# EasyEDA Pro project GIM4310-36(伺泰威新款电机).epro, board PCB1
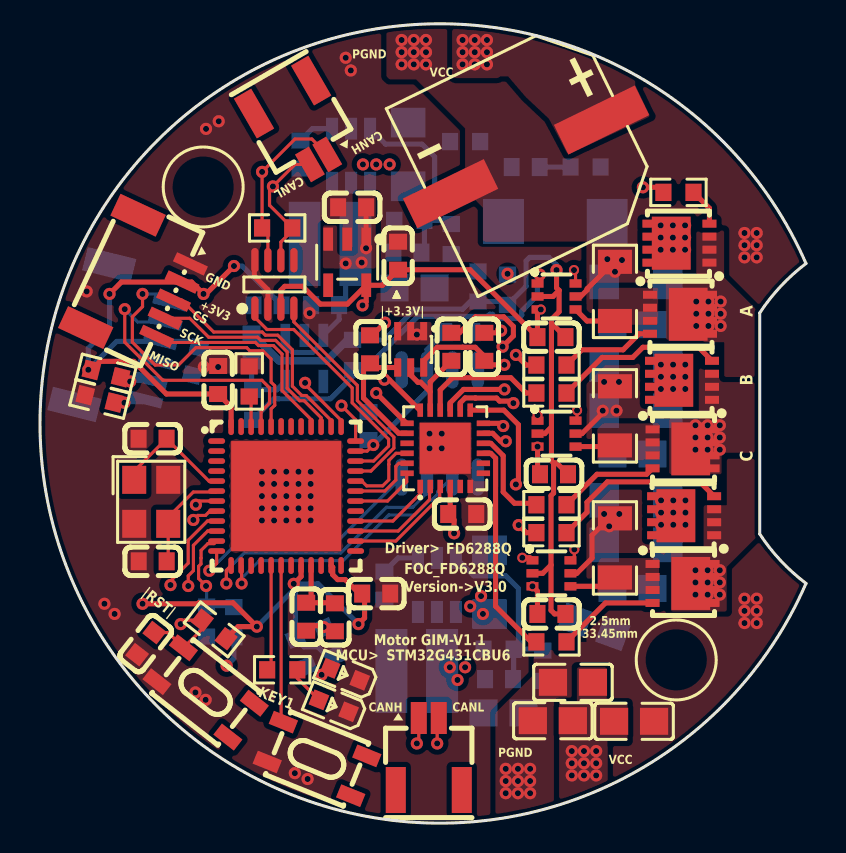
[diagram p1: board, top side]
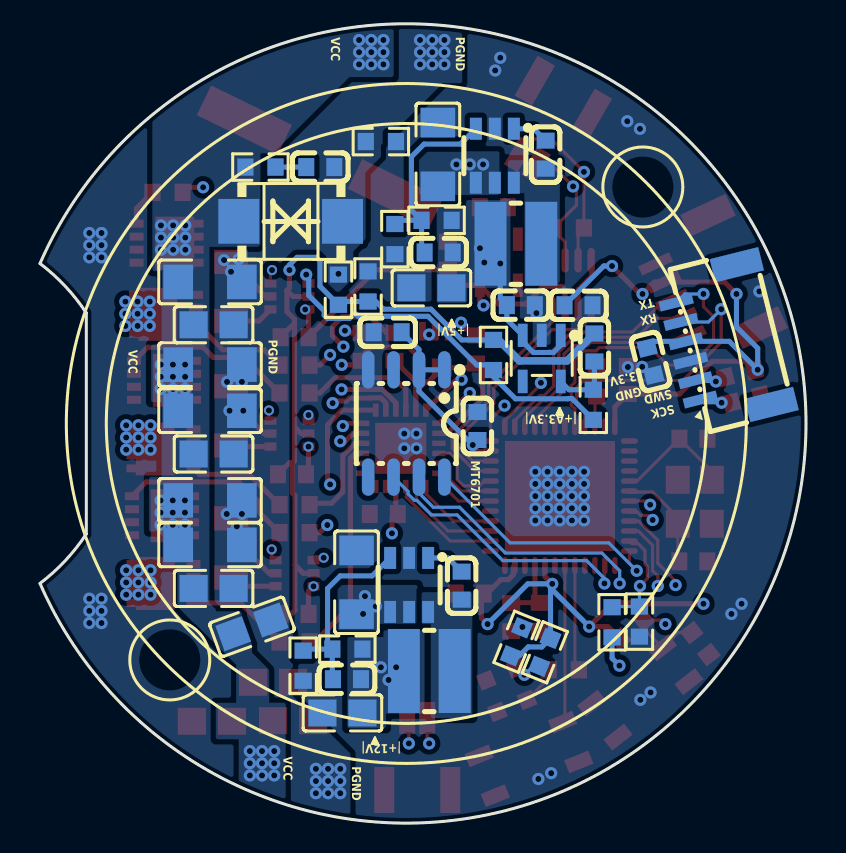
[diagram p2: board, bottom side, seen from below]

Outline 38.3 x 39.97 mm; copper layers: Top Layer, Inner1, Inner2, Inner3, Inner4, Inner5, Inner6, Inner7, Inner8, Inner9, Inner10, Inner11, Inner12, Inner13, Inner14, Inner15, Inner16, Inner17, Inner18, Inner19, Inner20, Inner21, Inner22, Inner23, Inner24, Inner25, Inner26, Inner27, Inner28, Inner29, Inner30, Bottom Layer. Coordinates in mm from the lower left corner of the outline.
Outline path: 35.99,25.52 arc(37.04,26.85) 38.3,27.99 arc(0,19.99) 38.3,11.99 arc(37.04,13.13) 35.99,14.46 35.99,25.52
Stack: Top Layer 0.035mm 外层铜厚1oz / Dielectric1 0.2104mm 7628 RC49% 8.6mil / Inner1 0.0152mm 内层铜厚 / Dielectric2 1.065mm 1.1mm H/HOZ Copper / Inner2 0.0152mm 内层铜厚 / Dielectric3 0.2104mm 7628 RC49% 8.6mil / Bottom Layer 0.035mm 外层铜厚1oz

## Design rules (mm)
spacing copperThickness1oz (default): track to track 0.102, other pairs 0.152 to 0.3
spacing copperThickness2oz: track to track 0.203, other pairs 0.152 to 0.3
spacing Plane_innerPlane: track to track 0.102, other pairs 0.152 to 0.3
spacing Copper_copperRegion: track to track 0.102, other pairs 0.152 to 0.3
track width copperThickness1oz (default): min 0.127, default 0.254, max 2.54
track width copperThickness2oz: min 0.203, default 0.254, max 2.54
differential pair differentialPair (default): width min 0.127, default 0.254, max 2.54; gap min 0.152, default 0.152
pour e969 uses Copper_copperRegion
pour e971 uses Copper_copperRegion
pour e973 uses Copper_copperRegion
pour e975 uses Copper_copperRegion
pour e977 uses Copper_copperRegion
pour e979 uses Copper_copperRegion
pour e981 uses Copper_copperRegion
pour e983 uses Copper_copperRegion
pour e985 uses Copper_copperRegion
pour e987 uses Copper_copperRegion
pour e989 uses Copper_copperRegion
pour e991 uses Copper_copperRegion
pour e993 uses Copper_copperRegion
pour e995 uses Copper_copperRegion
pour e997 uses Copper_copperRegion
pour e999 uses Copper_copperRegion
pour e1001 uses Copper_copperRegion
pour e1003 uses Copper_copperRegion
pour e1005 uses Copper_copperRegion
pour e1007 uses Copper_copperRegion
pour e1009 uses Copper_copperRegion
pour e1010 uses Copper_copperRegion
pour e1012 uses Copper_copperRegion
pour e1014 uses Copper_copperRegion
pour e1016 uses Copper_copperRegion
pour e1018 uses Copper_copperRegion
pour e1020 uses Copper_copperRegion
pour e1022 uses Copper_copperRegion
pour e1027 uses Copper_copperRegion
pour e1030 uses Copper_copperRegion
pour e1033 uses Copper_copperRegion
pour e1036 uses Copper_copperRegion
pour e1039 uses Copper_copperRegion
pour e1046 uses Copper_copperRegion
pour e1048 uses Copper_copperRegion

## Placement (name value [footprint] x y rotation side)
C12  47uF/50V  [C1206]  18.41 33.44 270 bottom
C13  100pF  [C0603]  18.37 28.54 180 bottom
C14  22uF/25V  [C0805]  18.73 26.77 180 bottom
C29  10uF  [C0603]  11.38 25.9 0 bottom
C35  100nF  [C0603]  16.81 11.48 180 top
C36  100nF  [C0603]  16.43 19.86 270 bottom
C37  100nF  [C0603]  8.91 22.16 270 top
C41  1uF  [C0603]  14.74 10.3 270 top
C42  10nF  [C0603]  13.31 10.33 270 top
C45  100nF  [C0603]  5.29 8.98 232 top
C54  10nF/50V  [C0603]  24.29 32.81 180 bottom
C55  22uF/50V  [C1206]  29.8 16.14 0 bottom
C61  22uF/50V  [C1206]  29.8 13.92 0 bottom
C65  100nF  [C0603]  17.91 28.38 90 top
C68  100nF  [C0603]  20.92 24.55 0 bottom
C71  20pF  [C0603]  5.63 19.23 0 top
C72  20pF  [C0603]  5.63 13.1 0 top
C100  100nF  [C0603]  13.02 33.43 270 bottom
C101  100nF  [C0603]  17.22 11.88 270 bottom
C102  47uF/50V  [C1206]  22.48 12.05 270 bottom
C103  100pF  [C0603]  22.95 7.2 180 bottom
C104  22uF/25V  [C0805]  23.18 5.51 180 bottom
C105  100nF  [C0603]  15.61 30.8 180 top
C106  100nF  [C0603]  10.58 23.79 90 bottom
C107  100nF  [C0603]  14.26 25.91 180 bottom
C108  22uF/50V  [C1206]  29.8 20.63 0 bottom
C109  22uF/50V  [C1206]  29.8 22.93 0 bottom
C112  100nF  [C0603]  7.77 23.09 76 bottom
C120  100nF  [C0603]  25.57 24.31 180 top
C121  100nF  [C0603]  25.7 17.45 180 top
C122  100nF  [C0603]  25.57 10.46 180 top
C123  1uF/25V  [C0603]  16.5 23.7 270 top
C124  1uF/25V  [C0603]  20.57 23.82 270 top
C125  1uF/25V  [C0603]  22.22 23.82 270 top
C126  10uF/25V  [C0603]  21.11 15.46 180 top
C127  22uF/50V  [C1206]  29.8 27.07 0 bottom
C130  330uF  [CAP-SMD_BD10.0-L10.3-W10.3-FD-LS11.0]  24.3 33.32 206 top
C131  10uF/50V  [C0805]  29.62 24.93 0 bottom
C132  10uF/50V  [C0805]  29.62 18.46 0 bottom
C133  10uF/50V  [C0805]  29.62 11.74 0 bottom
C134  10uF/50V  [C0805]  25.64 5.12 0 top
C136  10uF/50V  [C0805]  29.71 5.1 180 top
C138  10uF/50V  [C0805]  26.65 7.04 0 top
C139  10uF/50V  [C0805]  27.7 9.82 340 bottom
D3  BAS16TW  [SOT-363_L2.1-W1.3-P0.65-LS2.3-BL]  18.54 23.7 180 top
D4  SMBJ36CA  [SMB_L4.4-W3.6-LS5.3-BI]  25.77 30.1 180 bottom
L1  3.3uH  [IND-SMD_L3.8-W3.8_GCRH3D16-XX]  18.84 7.61 0 bottom
L2  3.3uH  [IND-SMD_L3.8-W3.8_GCRH3D16-XX]  14.51 28.97 0 bottom
LED6  KT-0603R  [LED0603-RD]  15.25 7.44 158 top
LED7  KT-0603R  [LED0603-RD]  14.69 5.87 158 top
Q7  NCEP3040Q  [POWERVDFN-8_L3.2-W3.1-P0.65-LS3.3-BL-1]  31.92 29.01 90 top
Q8  NCEP3040Q  [POWERVDFN-8_L3.2-W3.1-P0.65-LS3.3-BL-1]  32.05 22.15 90 top
Q9  NCEP3040Q  [POWERVDFN-8_L3.2-W3.1-P0.65-LS3.3-BL-1]  32.16 15.38 90 top
Q10  NCEP3040Q  [POWERVDFN-8_L3.2-W3.1-P0.65-LS3.3-BL-1]  32.05 25.45 270 top
Q11  NCEP3040Q  [POWERVDFN-8_L3.2-W3.1-P0.65-LS3.3-BL-1]  32.18 18.72 270 top
Q12  NCEP3040Q  [POWERVDFN-8_L3.2-W3.1-P0.65-LS3.3-BL-1]  32.18 11.99 270 top
R24  120  [R0603]  11.86 29.77 0 top
R28  0  [R0603]  14.48 9.07 292 bottom
R29  10K  [R0603]  10.46 22.09 90 top
R30  1K  [R0603]  8.71 9.69 142 top
R33  3.3  [R0603]  27.28 32.81 0 bottom
R42  10  [R0603]  31.92 31.55 0 top
R52  10  [R0603]  25.57 21.51 0 top
R53  10  [R0603]  25.57 14.53 0 top
R54  10  [R0603]  25.57 22.91 0 top
R56  10  [R0603]  25.57 9.07 0 top
R60  10  [R0603]  25.57 15.93 0 top
R65  34.8K  [R0603]  9.69 10.05 270 bottom
R67  4.99K  [R0603]  8.33 10.08 90 bottom
R68  3mΩ  [R1206]  28.75 26.59 270 top
R69  3mΩ  [R1206]  28.75 20.37 270 top
R70  3mΩ  [R1206]  28.75 13.77 270 top
R72  110K  [R0603]  18.47 30.15 0 bottom
R73  15K  [R0603]  20.56 29.21 90 bottom
R74  390K  [R0603]  22.93 8.7 0 bottom
R75  20K  [R0603]  25.14 7.87 90 bottom
R79  1K  [R0603]  13.06 8.55 292 bottom
R80  0  [R0603]  21.9 26.84 270 bottom
R81  0  [R0603]  21.26 34.09 0 bottom
R82  0  [R0603]  23.38 26.68 90 bottom
R85  10K  [R0603]  3.3 22.48 166 top
R86  10K  [R0603]  2.99 21.22 346 top
R101  10K  [R0603]  10.64 20.92 270 bottom
R102  10K  [R0603]  15.63 23.41 90 bottom
R103  1K  [R0603]  12.11 7.67 0 top
SW1  K2-1808SN-A3SW-01  [SW-SMD_4P-L4.2-W3.3-P2.15-LS5.1]  8.28 6.54 322 top
SW3  K2-1808SN-A3SW-01  [SW-SMD_4P-L4.2-W3.3-P2.15-LS5.1]  13.85 3.21 338 top
U1  STM32G431CBU6  [VQFN-48_L7.0-W7.0-P0.50-BL-EP5.5]  12.31 16.36 270 top
U2  INA199A1DCKR  [SC-70-6_L2.2-W1.3-P0.65-LS2.1-BR]  25.83 26.34 180 top
U4  INA199A1DCKR  [SC-70-6_L2.2-W1.3-P0.65-LS2.1-BR]  25.57 12.5 180 top
U5  MAX3051EKA+T  [SOT-23-8_L3.0-W1.7-P0.65-LS2.8-TL]  11.72 26.94 90 top
U10  FD6288Q  [QFN-24_L4.0-W4.0-P0.50-BL-EP2.6]  20.26 18.75 0 top
U11  MT6701CT-STD  [SOP-8_L4.9-W3.9-P1.27-LS6.0-BL]  19.99 19.99 0 bottom
U13  SPX3819M5-L-3-3/TR  [SOT-23-5_L3.0-W1.7-P0.95-LS2.8-BL]  15.36 28.05 180 top
U20  INA199A1DCKR  [SC-70-6_L2.2-W1.3-P0.65-LS2.1-BR]  25.83 19.48 180 top
U23  ME3121AM6G  [SOT-23-6_L2.9-W1.6-P0.95-LS2.8-BR]  15.56 33.38 90 bottom
U24  ME3121AM6G  [SOT-23-6_L2.9-W1.6-P0.95-LS2.8-BR]  19.85 11.91 90 bottom
U25  SPX3819M5-L-3-3/TR  [SOT-23-5_L3.0-W1.7-P0.95-LS2.8-BL]  13.21 23.24 0 bottom
U27  ZX-SH1.0-2PWT  [CONN-SMD_2P-P1.00_HX-1.0-2P-WT]  19.44 3.46 0 top
U28  ZX-SH1.0-2PWT  [CONN-SMD_2P-P1.00_HX-1.0-2P-WT]  13.03 34.75 210 top
U29  ZX-SH1.0-6PWT  [CONN-SMD_6P-P1.00_MEGASTAR_ZX-SH1.0-6PWT]  4.24 24.02 76 bottom
U30  ZX-SH1.0-5PWT  [CONN-SMD_5P-P1.00_MEGASTAR_ZX-SH1.0-5PWT]  5.14 26.87 245 top
X3  8MHz  [CRYSTAL-SMD_4P-L3.2-W2.5-BL]  5.56 16.07 270 top

## Footprints (pads in the part's own frame, mm; a bottom-side part is the same pattern mirrored in y, then rotated)
C0603
  rect 0.8x0.9 smd: 1(-0.7,0) 2(0.7,0)
C0805
  rect 1.41x1.35 smd: 1(-1,0) 2(1,0)
C1206
  rect 1.485x1.728 smd: 1(-1.593,0) 2(1.593,0)
CAP-SMD_BD10.0-L10.3-W10.3-FD-LS11.0
  rect 4.5x1.65 smd: 1(-4.2,0) 2(4.2,0)
CONN-SMD_2P-P1.00_HX-1.0-2P-WT
  rect 0.8x1.6 smd: 1(-0.5,1.8) 2(0.5,1.8)
  rect 1x2.3 smd: 3(1.65,-1.8) 4(-1.65,-1.8)
CONN-SMD_5P-P1.00_MEGASTAR_ZX-SH1.0-5PWT
  rect 0.5x1.7 smd: 1(-2,1.7) 2(-1,1.7) 3(0,1.7) 4(1,1.7) 5(2,1.7)
  rect 1.2x2.5 smd: 6(3.1,-1.7) 7(-3.1,-1.7)
CONN-SMD_6P-P1.00_MEGASTAR_ZX-SH1.0-6PWT
  rect 0.5x1.7 smd: 1(-2.5,1.7) 2(-1.5,1.7) 3(-0.5,1.7) 4(0.5,1.7) 5(1.5,1.7) 6(2.5,1.7)
  rect 1.2x2.5 smd: 7(3.6,-1.7) 8(-3.6,-1.7)
CRYSTAL-SMD_4P-L3.2-W2.5-BL
  rect 1.4x1.2 smd: 1(-1.1,-0.85) 2(1.1,-0.85) 3(1.1,0.85) 4(-1.1,0.85)
IND-SMD_L3.8-W3.8_GCRH3D16-XX
  rect 1.6x4.2 smd: 1(-1.27,0) 2(1.27,0)
LED0603-RD
  rect 0.8x0.8 smd: 1(-0.799,0) 2(0.799,0)
POWERVDFN-8_L3.2-W3.1-P0.65-LS3.3-BL-1
  rect 0.4x0.7 smd: 1(-0.975,-1.55) 2(-0.325,-1.55) 3(0.325,-1.55) 4(0.975,-1.55)
  rect 0.4x0.5 smd: 5(0.975,1.55) 6(0.325,1.55) 7(-0.325,1.55) 8(-0.975,1.55)
  rect 2.65x1.94 smd: 8(0,0.36)
QFN-24_L4.0-W4.0-P0.50-BL-EP2.6
  rect 0.28x0.665 smd: 1(-1.25,-1.907) 2(-0.75,-1.907) 3(-0.25,-1.907) 4(0.25,-1.907) 5(0.75,-1.907) 6(1.25,-1.907) 13(1.25,1.907) 14(0.75,1.907) 15(0.25,1.907) 16(-0.25,1.907) 17(-0.75,1.907) 18(-1.25,1.907)
  rect 0.665x0.28 smd: 7(1.907,-1.25) 8(1.907,-0.75) 9(1.907,-0.25) 10(1.907,0.25) 11(1.907,0.75) 12(1.907,1.25) 19(-1.907,1.25) 20(-1.907,0.75) 21(-1.907,0.25) 22(-1.907,-0.25) 23(-1.907,-0.75) 24(-1.907,-1.25)
  rect 2.55x2.55 smd: 25(0,0)
R0603
  rect 0.806x0.864 smd: 1(-0.753,0) 2(0.753,0)
R1206
  rect 1.208x1.701 smd: 1(-1.479,0) 2(1.479,0)
SC-70-6_L2.2-W1.3-P0.65-LS2.1-BR
  rect 0.6x0.42 smd: 1(0.95,-0.65) 2(0.95,0) 3(0.95,0.65) 4(-0.95,0.65) 5(-0.95,0) 6(-0.95,-0.65)
SMB_L4.4-W3.6-LS5.3-BI
  rect 2.047x2.241 smd: 1(-2.591,0) 2(2.591,0)
SOP-8_L4.9-W3.9-P1.27-LS6.0-BL
  oval 0.63x1.865 smd: 1(-1.905,-2.683) 2(-0.635,-2.683) 3(0.635,-2.683) 4(1.905,-2.683) 5(1.905,2.683) 6(0.635,2.683) 7(-0.635,2.683) 8(-1.905,2.683)
SOT-23-5_L3.0-W1.7-P0.95-LS2.8-BL
  rect 0.49x1.157 smd: 1(-0.95,-1.153) 2(0,-1.153) 3(0.95,-1.153)
  rect 0.49x1.175 smd: 4(0.95,1.153) 5(-0.95,1.153)
SOT-23-6_L2.9-W1.6-P0.95-LS2.8-BR
  rect 1.1x0.6 smd: 1(1.35,-0.95) 2(1.35,0) 3(1.35,0.95) 4(-1.35,0.95) 5(-1.35,0) 6(-1.35,-0.95)
SOT-23-8_L3.0-W1.7-P0.65-LS2.8-TL
  oval 1.222x0.364 smd: 1(-1.211,0.975) 2(-1.211,0.325) 3(-1.211,-0.325) 4(-1.211,-0.975) 5(1.211,-0.975) 6(1.211,-0.325) 7(1.211,0.325) 8(1.211,0.975)
SOT-363_L2.1-W1.3-P0.65-LS2.3-BL
  rect 0.35x0.916 smd: 1(-0.65,-0.908) 2(0,-0.908) 3(0.65,-0.908) 4(0.65,0.908) 5(0,0.908) 6(-0.65,0.908)
SW-SMD_4P-L4.2-W3.3-P2.15-LS5.1
  rect 1.3x0.7 smd: 1(-2.25,1.075) 2(2.25,1.075) 3(-2.25,-1.075) 4(2.25,-1.075)
VQFN-48_L7.0-W7.0-P0.50-BL-EP5.5
  oval 0.28x0.85 smd: 1(-2.75,-3.474) 2(-2.25,-3.474) 3(-1.75,-3.474) 4(-1.25,-3.474) 5(-0.75,-3.474) 6(-0.25,-3.474) 7(0.25,-3.474) 8(0.75,-3.474) 9(1.25,-3.474) 10(1.75,-3.474) 11(2.25,-3.474) 12(2.75,-3.474) 25(2.75,3.474) 26(2.25,3.474) 27(1.75,3.474) 28(1.25,3.474) 29(0.75,3.474) 30(0.25,3.474) 31(-0.25,3.474) 32(-0.75,3.474) 33(-1.25,3.474) 34(-1.75,3.474) 35(-2.25,3.474) 36(-2.75,3.474)
  oval 0.85x0.28 smd: 13(3.474,-2.75) 14(3.474,-2.25) 15(3.474,-1.75) 16(3.474,-1.25) 17(3.474,-0.75) 18(3.474,-0.25) 19(3.474,0.25) 20(3.474,0.75) 21(3.474,1.25) 22(3.474,1.75) 23(3.474,2.25) 24(3.474,2.75) 37(-3.474,2.75) 38(-3.474,2.25) 39(-3.474,1.75) 40(-3.474,1.25) 41(-3.474,0.75) 42(-3.474,0.25) 43(-3.474,-0.25) 44(-3.474,-0.75) 45(-3.474,-1.25) 46(-3.474,-1.75) 47(-3.474,-2.25) 48(-3.474,-2.75)
  rect 5.5x5.5 smd: 49(0,0)

## Nets
As in the schematic.

Pads without a net: SW1 2 4; SW3 2 4; U1 1 2 3 4 15 16 19 22 24 25 29 41 42 43 47; U5 5; U10 5 7 8 21; U11 3 5; U13 4; U25 4; U27 3 4; U28 3 4; U29 7 8; U30 6 7

## Via types
v1: diameter 0.61, hole 0.305, Top Layer to Bottom Layer, 218 vias
v2: diameter 0.508, hole 0.305, Top Layer to Bottom Layer, 8 vias

## Routing (per net, layer and track width the routed paths; a pad name or vN(x,y) marks a point on that pad's centre or on a via; arc(x,y) is an arc through that point)
+3.3V: length 129.8
  Top Layer w0.158: v1(16.66,18.91) 16.36,18.61 15.78,18.61
  Top Layer w0.254: R85.2 3,23.1 4.69,23.1 6.32,21.46 C37.2 9.56,20.81 9.56,19.83 ; v1(16.13,25.89) 16.31,26.08 U13.5 ; v2(24.88,18.83) 24.88,17.57 C121.2 ; U13.5 15.37,25.96 14.02,25.96 13.13,26.85 12.24,26.85 12.05,26.65 12.05,25.73 ; U13.5 17.13,26.9 C65.1 21.5,27.68 C120.2 24.87,25.52 v2(25.04,25.69) ; U1.23 14.64,12.8 14.64,12.43 14.88,12.18 15.26,12.18 15.88,11.56 16.23,11.56 16.23,10.26 v1(15.92,9.96) ; v1(5.13,10.97) 7.9,10.97 7.95,11.02 9.65,11.02 v1(10.84,9.83) 9.91,9.83 R30.1 ; v1(3.48,26.47) 4.07,27.06 U30.2 7.58,27.06 v1(8.18,26.47) 8.3,26.47 v1(9.7,27.86) ; U1.20 13.06,12.34 v1(12.69,11.97) ; C122.2 24.87,11.6 v2(24.62,11.85)
  Inner1 w0.254: v1(16.66,18.91) 15.8,19.78 15.8,24.94 16.13,25.27 v1(16.13,25.89) ; v1(5.13,10.97) 2.21,13.89 2.21,15.67 1.95,15.93 1.95,22.21 v1(2.42,22.67)
  Inner2 w0.254: v2(24.62,11.85) 24.88,12.1 24.88,13.84 24.91,13.87 24.91,18.54 24.88,18.58 v2(24.88,18.83) 25.45,19.4 25.45,20.86 25.23,21.07 25.23,25.5 v2(25.04,25.69) ; v1(8.18,26.47) 15.55,26.47 v1(16.13,25.89)
  Bottom Layer w0.254: v1(3.48,26.47) 3.48,24.82 2.42,23.75 v1(2.42,22.67) 3.84,24.1 U29.4 7.61,24.1 7.94,23.77 ; v1(9.7,27.86) 10.11,27.86 C29.2 ; C68.1 19.35,23.68 U11.2 ; v1(12.69,11.97) 12.78,11.88 R79.1 13.21,8.81 13.89,8.81 14.33,8.38 R28.2 ; v1(12.69,11.97) 12.69,11.68 v1(10.84,9.83) ; v1(12.69,11.97) 13.91,11.97 v1(15.92,9.96) ; U11.2 19.35,21.6 v1(16.66,18.91) ; U11.2 U11.1
+5V: length 9.2
  Top Layer w0.254: v1(16.3,28.75) 16.31,28.76 C105.1
  Bottom Layer w0.254: v1(15.29,27.99) 15.29,26.24 C107.1 14.96,25.19 U25.3 14.16,24.07 13.64,23.55 13.58,23.55 13.58,23.54 12.85,23.54 12.85,23.55 12.62,23.55 12.26,23.9 U25.1
  vias: v1(16.08,28.04)
+12V: length 2.5
  Top Layer w0.254: U10.4 20.51,15.56 C126.2 20.7,15.17 v1(20.7,14.5)
  vias: v1(18.84,24.43) v1(20.49,7.8) v1(20.88,7.16) v1(21.26,7.8)
+AVDD_3.3V: length 3.2
  Bottom Layer w0.254: C106.1 10.58,21.73 R101.1 11.85,21.68 U25.5
AGND: length 42.5
  Top Layer w0.254: 25.55,12.91 25.55,16.38 25.68,16.51 25.68,18.01 ; 25.55,12.91 25.55,10.64 25.73,10.46 C122.1 ; 25.55,12.91 25.14,12.5 U4.2 ; 25.96,26.65 25.96,25.58 25.57,25.2 25.57,25.01 ; 25.96,26.65 25.83,26.77 v1(25.83,27.66) ; 25.96,26.65 25.65,26.34 U2.2 ; 25.57,25.01 25.57,19.82 ; 25.57,25.01 C120.1 ; 25.57,19.82 25.57,18.12 25.68,18.01 ; 25.57,19.82 25.24,19.48 U20.2 ; C121.1 25.84,18.01 25.68,18.01
  Bottom Layer w0.254: v1(25.83,27.66) 25.83,27.92 25.45,28.3 24.48,28.3 24.3,28.12 24.3,26.85 R82.1 23.22,26.09 R80.2 21.51,26.09 21.13,25.7 18.75,25.7 17.21,24.17 15.63,24.17
  Bottom Layer w0.381: C106.2 11.95,23.12 14.33,23.12 15.37,24.17 15.63,24.17
GND: length 2.7
  Top Layer w0.254: U5.2 11.4,26.68 10.72,27.36 10.72,28.12 U5.8
  vias: v1(2.33,26.59) v1(3.22,10.97) v1(3.73,10.46) v1(7.77,6.54) v1(8.19,22.82) v1(8.3,34.72) v1(8.28,6.17) v1(8.91,22.81) v1(8.94,35.1) v1(11.1,17.58) v1(11.1,16.97) v1(11.1,16.36) v1(11.1,15.75) v1(11.1,15.14) v1(11.71,17.58) v1(11.71,16.97) v1(11.71,16.36) v1(11.71,15.75) v1(11.71,15.14) v1(12.32,17.58) v1(12.32,16.97) v1(12.32,16.36) v1(12.32,15.75) v1(12.32,15.14) v1(12.74,2.5) v1(12.93,17.58) v1(12.93,16.97) v1(12.93,16.36) v1(12.93,15.75) v1(12.93,15.14) v1(13.38,2.21) v1(13.48,25.51) v1(13.53,17.58) v1(13.53,16.97) v1(13.53,16.36) v1(13.53,15.75) v1(13.53,15.14) v1(15.29,38.28) v1(15.54,37.64) v1(19.48,19.48) v1(19.48,18.74) v1(20.09,19.48) v1(20.09,18.74)
PGND: length 8
  Top Layer w0.254: U20.5 27.1,19.48 28.14,20.52 v1(28.14,20.63) ; U4.5 26.84,12.5 27.61,13.26 27.61,14.4 28.05,14.85 v1(28.46,14.85) ; v1(28.75,27.58) 28.21,27.58 27.36,26.73 27.36,26.66 27.03,26.34 U2.5
  vias: v1(18.08,39.17) v1(18.08,38.56) v1(18.08,37.95) v1(18.69,39.17) v1(18.69,38.56) v1(18.69,37.95) v1(19.3,39.17) v1(19.3,38.56) v1(19.3,37.95) v1(23.29,2.72) v1(23.29,2.11) v1(23.29,1.5) v1(23.38,27.47) v1(23.9,2.72) v1(23.9,2.11) v1(23.9,1.5) v1(24.51,2.72) v1(24.51,2.11) v1(24.51,1.5) v1(28.21,22.07) v1(28.21,15.46) v1(28.37,28.21) v1(28.83,20.63) v1(28.95,22.07) v1(28.96,15.46) v1(29.1,28.16) v1(35.23,29.51) v1(35.23,28.9) v1(35.23,28.3) v1(35.23,11.23) v1(35.23,10.62) v1(35.23,10.01) v1(35.84,29.51) v1(35.84,28.9) v1(35.84,28.3) v1(35.84,11.23) v1(35.84,10.62) v1(35.84,10.01)
VCC: length 21.9
  Inner1 w0.254: v1(9.33,7.88) 14.62,2.59 20.88,2.59 22.4,4.11 26.08,4.11 v1(26.59,3.61)
  Bottom Layer w0.254: v1(9.33,7.88) 9.69,8.24 R65.2
  vias: v1(16.15,32.94) v1(16.81,32.94) v1(17.48,32.94) v1(21.13,39.17) v1(21.13,38.56) v1(21.13,37.95) v1(21.51,10.85) v1(21.74,39.17) v1(21.74,38.56) v1(21.74,37.95) v1(22.05,11.35) v1(22.15,10.46) v1(22.35,39.17) v1(22.35,38.56) v1(22.35,37.95) v1(26.59,3) v1(26.59,2.39) v1(27.2,3.61) v1(27.2,3) v1(27.2,2.39) v1(27.81,3.61) v1(27.81,3) v1(27.81,2.39) v1(31.04,29.9) v1(31.04,29.29) v1(31.04,28.68) v1(31.05,22.93) v1(31.05,22.32) v1(31.05,21.71) v1(31.05,16.14) v1(31.05,15.53) v1(31.05,14.92) v1(31.64,29.9) v1(31.64,29.29) v1(31.64,28.68) v1(31.66,22.93) v1(31.66,22.32) v1(31.66,21.71) v1(31.66,16.14) v1(31.66,15.53) v1(31.66,14.92) v1(32.25,29.9) v1(32.25,29.29) v1(32.25,28.68) v1(32.27,22.93) v1(32.27,22.32) v1(32.27,21.71) v1(32.27,16.14) v1(32.27,15.53) v1(32.27,14.92)
VDDA: length 3.4
  Top Layer w0.254: C41.1 14.72,11.03 C42.1 13.56,11.27 U1.21
ADC_IN1: length 47.5
  Top Layer w0.158: v1(7.67,15.16) 7.89,15.39 8.27,15.39 8.43,15.55 8.77,15.55 U1.8 ; U2.6 26.78,27.58 v2(26.7,27.66)
  Inner2 w0.158: v2(26.7,27.66) 26.7,21.78 27.35,21.13 27.35,19.86 27.1,19.61 27.1,14.91 27.48,14.53 27.48,14.26 27.48,14.26 27.48,13.15 27.48,13.15 27.48,12.88 26.08,11.48 26.08,9.96 24.56,8.43 9.7,8.43 7.29,10.85 6.65,10.85 5.89,11.61 5.89,12.12 6.27,12.5 6.65,12.5 7.67,13.51 v1(7.67,15.16)
ADC_IN2: length 37.5
  Top Layer w0.158: v2(26.85,20.64) 26.85,20.21 U20.6 ; v1(6.52,11.91) 6.52,12.11 6.97,12.55 6.97,12.56 7.41,13 7.41,14.15 8.37,15.11 U1.9
  Inner2 w0.158: v1(6.52,11.91) 6.52,11.73 7.03,11.23 7.41,11.23 9.83,8.81 24.43,8.81 25.7,10.08 25.7,11.73 27.23,13.26 27.23,14.15 26.73,14.65 26.73,20.51 v2(26.85,20.64)
ADC_IN3: length 27.6
  Top Layer w0.158: v2(26.72,13.69) 26.72,13.34 26.52,13.15 ; U1.10 8.38,14.61 7.67,13.9 7.67,12.63 7.41,12.37 v1(7.41,11.86)
  Inner2 w0.158: v2(26.72,13.69) 25.32,12.29 25.32,10.34 24.18,9.19 10.08,9.19 v1(7.41,11.86)
ADC_IN4: length 5.4
  Top Layer w0.158: v1(8.3,11.86) 7.93,12.23 7.93,12.85 8.05,12.96 8.05,13.26 8.05,13.26 8.05,13.64 8.39,13.98 8.7,13.98 U1.11
  Bottom Layer w0.158: R65.1 9.66,10.83 R67.2 8.33,11.84 v1(8.3,11.86)
BOOT0: length 1.5
  Top Layer w0.158: R29.1 10.56,21.24 10.56,19.83
CANH: length 41.8
  Top Layer w0.158: v1(18.84,3.99) 18.94,4.08 U27.1 ; R24.1 v1(11.1,32.57) 12.75,34.21 13.59,34.21 14.36,33.44 ; U5.7 11.4,29.6 11.24,29.76
  Inner1 w0.158: v1(18.84,3.99) 18.84,14.66 11.1,22.39 v1(11.1,32.57)
CANL: length 41.6
  Top Layer w0.158: 12.74,29.76 12.05,29.06 12.05,28.15 ; U27.2 19.86,5.18 v1(19.86,3.99) ; 13.5,32.94 12.75,32.94 v1(11.65,31.84) 11.48,31.67 11.48,30.9 R24.2
  Inner1 w0.158: v1(19.86,3.99) 19.35,4.5 19.35,15.04 11.65,22.74 11.65,22.8 arc(11.79,23.15) 12.13,23.29 arc(12.48,23.43) 12.62,23.78 12.62,23.82 arc(12.48,24.16) 12.13,24.3 arc(11.79,24.45) 11.65,24.79 11.65,24.83 arc(11.79,25.18) 12.13,25.32 arc(12.48,25.46) 12.62,25.81 12.62,25.85 arc(12.48,26.19) 12.13,26.34 arc(11.79,26.48) 11.65,26.82 v1(11.65,31.84)
FDCAN1_RX: length 11.4
  Top Layer w0.158: 15.78,17.61 16.55,17.61 17.69,18.76 17.69,19.31 15.87,21.13 15.87,21.89 12.7,25.07 U5.4
FDCAN1_TX: length 12.4
  Top Layer w0.158: U5.1 10.72,25.7 10.72,25.32 11.35,24.69 12.69,24.69 15.61,21.77 15.61,21.02 17.43,19.2 17.43,18.86 16.68,18.11 15.78,18.11
GH_A: length 23.5
  Top Layer w0.254: v1(30.15,31.8) 30.92,31.8 R42.1 ; v1(16.81,21.51) 18.33,20 U10.19
  Inner1 w0.254: v1(30.15,31.8) 26.95,28.6 20.32,28.6 17.67,25.96 17.32,25.96 16.43,25.07 16.43,21.89 v1(16.81,21.51)
GH_B: length 6.4
  Top Layer w0.254: U10.16 20.01,21.67 20.62,22.28 23.54,22.28 24.3,21.51 R52.1
GH_C: length 8.9
  Top Layer w0.254: v1(23.8,16.94) 23.92,17.07 23.92,19.93 23.19,20.65 U10.13 ; R53.1 24.32,14.53 v1(23.94,14.91)
  Inner1 w0.254: v1(23.8,16.94) 23.8,15.05 v1(23.94,14.91)
GL_A: length 13.1
  Top Layer w0.254: v1(23.29,19.1) 23.03,19.1 22.64,19.5 U10.11 ; v1(23.8,23.42) 24.3,22.91 R54.1
  Inner1 w0.254: v1(23.8,23.42) 23.8,23.93 24.18,24.31 24.18,24.94 23.8,25.32 22.78,25.32 21.79,24.33 21.79,20.41 22.92,19.28 23.11,19.28 v1(23.29,19.1)
GL_B: length 5
  Top Layer w0.254: U10.10 22.54,19 23.16,18.38 23.16,16.56 23.72,16 24.75,16 R60.1
GL_C: length 10.9
  Top Layer w0.254: U10.9 22.54,18.5 22.78,18.25 22.78,10.85 24.56,9.07 R56.1
KEY1: length 7.9
  Top Layer w0.158: U1.18 12.06,5.17 SW3.1
LED1: length 5.3
  Top Layer w0.158: U1.17 11.56,7.74 11.42,7.61
NRST: length 16.5
  Top Layer w0.158: v1(7.03,9.96) 7.23,10.15 R30.2 8.12,9.71 SW1.1 6.41,9.53 C45.1 ; U1.7 7.98,16.11 v1(7.79,15.93)
  Inner1 w0.158: v1(7.79,15.93) 9.45,14.27 9.45,13.13 9.95,12.62 10.59,12.62 10.97,12.24 10.97,11.48 9.7,10.21 7.29,10.21 v1(7.03,9.96)
OSC_IN: length 6.1
  Top Layer w0.158: U1.5 8.45,17.11 C71.2 4.71,17.61 X3.1
OSC_OUT: length 5.2
  Top Layer w0.158: C72.2 6.41,13.17 X3.3 6.41,15.3 7.67,16.56 8.78,16.56 U1.6
PWMAH: length 3.9
  Top Layer w0.158: U10.22 17.8,18.5 17.45,18.14 17.45,17.94 17.44,17.94 17.44,17.18 17.13,16.87 16.33,16.87 16.09,17.11 15.78,17.11
PWMAL: length 4.2
  Top Layer w0.158: 15.78,15.11 17.65,15.11 19.01,16.48 U10.1
PWMBH: length 3.5
  Top Layer w0.158: U10.23 17.95,18 17.79,17.84 17.79,17.16 17.24,16.61 15.78,16.61
PWMBL: length 5
  Top Layer w0.158: U10.2 19.48,16.81 19.48,16.18 17.91,14.61 15.78,14.61
PWMCH: length 3.4
  Top Layer w0.158: 15.78,16.11 17.38,16.11 18.34,17.07 18.34,17.48 U10.24
PWMCL: length 5.7
  Top Layer w0.158: U10.3 19.99,16.81 19.99,16.31 17.79,14.11 15.78,14.11
REF: length 34.7
  Top Layer w0.254: U2.1 24.99,27.1 v1(24.99,27.43) ; v2(24.88,20.41) U20.1 ; v2(24.12,13.27) 24.5,13.27 24.62,13.15
  Inner2 w0.254: v1(24.99,27.43) 24.51,26.95 24.51,25.47 24.88,25.1 v2(24.88,20.41) 24.35,19.88 24.35,18.61 24.56,18.4 24.56,14.02 24.12,13.58 v2(24.12,13.27)
  Bottom Layer w0.254: R101.2 11.71,21.24 11.89,21.24 11.9,21.22 14.53,21.22 15.63,22.33 R102.1 15.88,22.92 16.46,22.92 18.9,25.35 22.39,25.35 22.49,25.45 22.62,25.45 22.83,25.24 23.93,25.24 24.09,25.41 24.09,25.62 24.86,26.39 24.86,27.31 v1(24.99,27.43)
SH_A: length 27.1
  Top Layer w0.254: U10.18 18.99,20.65 17.47,22.18 v1(17.22,22.18) ; v1(17.25,25.03) 16.62,24.4 C123.1
  Inner1 w0.254: v1(32.81,24.87) 32,24.05 27.99,24.05 27.35,24.69 27.35,27.86 26.97,28.24 20.46,28.24 v1(17.25,25.03) 17.25,22.21 v1(17.22,22.18)
  vias: v1(32.81,26.09) v1(32.81,25.48) v1(33.42,26.09) v1(33.42,25.48) v1(33.42,24.87) v1(34.03,26.09) v1(34.03,25.48) v1(34.03,24.87)
SH_B: length 22.7
  Top Layer w0.254: C124.1 20.97,24.52 21.77,25.32 23.19,25.32 23.67,24.84 23.67,24.37 v1(23.13,23.83) ; U10.15 20.51,20.66 20.51,21.02 21.18,21.69 v1(23.22,21.69)
  Inner1 w0.254: v1(23.13,23.83) 23.05,23.75 22.92,23.75 22.58,23.41 22.58,23.34 22.53,23.29 22.53,22.39 v1(23.22,21.69) 23.22,21.39 23.09,21.25 23.09,20.76 23.43,20.42 23.91,20.42 24.75,21.26 30.27,21.26 31.63,19.9 v1(32.77,19.9)
  vias: v1(32.77,19.29) v1(32.77,18.68) v1(33.38,19.9) v1(33.38,19.29) v1(33.38,18.68) v1(33.99,19.9) v1(33.99,19.29) v1(33.99,18.68)
SH_C: length 21.5
  Top Layer w0.254: v1(23.06,24.63) 22.95,24.52 C125.1 ; U10.12 23.03,20 v1(23.16,19.86)
  Inner1 w0.254: v1(32.77,12.65) 32.65,12.65 31.65,13.64 30.53,13.64 30.15,14.02 30.15,15.93 29.51,16.56 28.37,16.56 26.84,18.08 24.81,18.08 23.87,19.02 23.87,19.34 23.48,19.74 23.29,19.74 v1(23.16,19.86) 22.91,19.86 22.15,20.62 22.15,23.72 v1(23.06,24.63)
  vias: v1(32.77,12.04) v1(32.77,11.43) v1(33.38,12.65) v1(33.38,12.04) v1(33.38,11.43) v1(33.99,12.65) v1(33.99,12.04) v1(33.99,11.43)
SL_A: length 2.2
  Top Layer w0.254: R68.2 27.35,25.11 U2.4
SL_B: length 2
  Top Layer w0.254: R69.2 28.69,18.83 U20.4
SL_C: length 2.4
  Top Layer w0.254: R70.2 28.31,11.85 U4.4
SPI1_CS: length 12.7
  Top Layer w0.158: U1.12 8.83,12.99 v1(8.47,12.62)
  Bottom Layer w0.158: U11.8 14.79,14.02 9.86,14.02 v1(8.47,12.62)
SPI1_MISO: length 13.9
  Top Layer w0.158: U1.14 10.08,12.86 v1(10.08,11.99)
  Bottom Layer w0.158: U11.6 19.9,16.58 19.9,16.46 19.58,16.14 19.46,16.14 18.73,15.42 17.45,15.42 15.16,13.13 10.97,13.13 10.08,12.24 v1(10.08,11.99)
SPI1_SCK: length 14.1
  Top Layer w0.158: U1.13 9.32,12.65 v1(9.32,11.99)
  Bottom Layer w0.158: v1(9.32,11.99) 9.32,12.62 10.21,13.51 15.03,13.51 17.32,15.8 18.64,15.8 19.35,16.51 U11.7
SPI3_CS: length 11.7
  Top Layer w0.158: 14.56,19.83 14.56,20.14 13.31,21.39 13.09,21.39 12.62,21.86 12.62,23.67 11.89,24.4 11.27,24.4 11.11,24.56 8.68,24.56 7.09,26.16 U30.3
SPI3_MISO: length 10.9
  Top Layer w0.158: 13.56,19.83 13.56,20.19 12.1,21.64 12.1,23.46 11.67,23.88 10.93,23.88 10.77,24.04 6.13,24.04 U30.5
SPI3_SCK: length 11.4
  Top Layer w0.158: U30.4 7.49,25.25 8.43,24.3 10.88,24.3 11.04,24.14 11.78,24.14 12.36,23.57 12.36,21.75 12.98,21.13 13.21,21.13 14.06,20.28 14.06,19.83
SWCLK: length 14
  Top Layer w0.158: 15.06,19.83 15.06,20.14 13.26,21.94 v1(13.26,22.02) ; R86.2 4.21,21.04 v1(4.22,21.03)
  Inner2 w0.158: v1(4.22,21.03) 12.26,21.03 v1(13.26,22.02)
  Bottom Layer w0.158: v1(4.22,21.03) 5.13,21.03 5.28,21.18
SWDIO: length 15.8
  Top Layer w0.158: v1(4.51,22.09) 4.3,22.3 R85.1 ; 15.78,19.11 15.78,20.18 v1(15.07,20.88)
  Inner2 w0.158: v1(4.51,22.09) 5.31,21.29 11.38,21.29 12.65,22.56 13.48,22.56 15.07,20.96 v1(15.07,20.88)
  Bottom Layer w0.158: v1(4.51,22.09) 5.46,22.09 U29.2
U1_RX: length 14.2
  Top Layer w0.158: 11.06,19.83 11.06,20.58 11.48,21.01 11.48,21.77 11.1,22.15 6.14,22.15 4.24,24.05 v1(4.24,25.7)
  Bottom Layer w0.158: v1(4.24,25.7) 4.88,25.07 U29.5
U1_TX: length 15.7
  Top Layer w0.158: v1(5.13,26.47) 5.13,25.83 4.62,25.32 4.62,24.05 5.76,22.91 6.92,22.91 7.79,23.78 10.33,23.78 10.49,23.63 11.14,23.63 11.56,23.21 11.56,22.06 11.74,21.87 11.74,20.9 11.56,20.72 11.56,19.83
  Bottom Layer w0.158: U29.6 6.06,26.47 v1(5.13,26.47)
VB_A: length 6.2
  Top Layer w0.254: D3.4 16.71,22.79 C123.2 16.18,22.67 16.18,21.26 17.94,19.5 U10.20
VB_B: length 4.6
  Top Layer w0.254: 19.51,21.57 19.04,22.05 18.89,22.05 18.54,22.41 D3.5 ; 19.51,21.57 19.51,22.07 C124.2 ; 19.51,21.57 U10.17
VB_C: length 10.6
  Top Layer w0.254: v1(23.22,22.92) 22.42,22.92 C125.2 22.22,23.35 21.76,23.8 21.14,23.8 21.13,23.8 19.86,23.8 19.19,23.13 D3.6 ; v1(23.67,21.01) 23.57,21.11 22.98,21.11 22.83,21.26 21.77,21.26 21.77,21.27 21.26,21.27 21.01,21.02 U10.14
  Inner1 w0.254: v1(23.67,21.01) 23.81,21.14 23.81,21.93 23.8,21.94 23.8,22.34 v1(23.22,22.92)
$1N8719: length 9.9
  Bottom Layer w0.254: R74.2 25.07,8.7 R75.2 ; R74.2 23.92,8.94 23.92,11.73 23.29,12.37 21.69,12.37 20.8,13.26 ; R74.2 23.69,7.23 C103.1
$1N8722: length 2
  Bottom Layer w0.254: 18.9,13.26 17.9,13.26 C101.1
$1N8723: length 1.5
  Top Layer w0.158: v1(14.08,7.42) 14.18,7.42 14.51,7.74
  Bottom Layer w0.158: v1(14.08,7.42) 13.65,7.85 R79.2
$1N8729: length 10.3
  Bottom Layer w0.254: R73.2 20.37,30.15 R72.2 ; C13.1 19.22,28.69 R72.2 ; U23.3 17.28,33.96 19.1,33.96 19.73,33.32 19.73,30.66 R72.2
$1N8746: length 4.8
  Top Layer w0.254: Q10.4 29.96,24.48 29.16,23.67 27.09,23.67 R54.2
$1N8787: length 5.1
  Top Layer w0.254: R56.2 28.27,11.01 Q12.4
$1N8794: length 9
  Top Layer w0.254: 33.71,16.35 32.99,17.07 28.37,17.07 27.35,16.05 27.35,15.55 R53.2
$1N8801: length 8.5
  Top Layer w0.254: R52.2 28.11,23.29 29.64,23.29 30.15,23.8 32.93,23.8 Q8.4
$1N8806: length 5.1
  Top Layer w0.254: R60.2 27.85,17.45 30.33,17.45 Q11.4
$1N8809: length 1.9
  Top Layer w0.254: Q7.4 33.47,30.75 R42.2
$1N8836: length 1.8
  Bottom Layer w0.254: C100.1 13.61,34.73 U23.1
$1N8841: length 1.5
  Bottom Layer w0.254: C54.1 26.53,32.81
$1N11171: length 1.5
  Top Layer w0.254: 14.74,9.85 14.71,9.81 v1(14.18,9.81) 14.11,9.88 13.31,9.88
$1N11271: length 2
  Top Layer w0.158: LED7.2 12.87,7.25 R103.2

## Copper pours and planes (outline as drawn; the poured copper is in the pictures)
+5V on Top Layer: 14.14,29.9 14.14,27.74 16.79,27.74 16.79,31.42 15.89,31.42 15.89,28.5 14.87,28.5 14.87,29.9
+5V on Bottom Layer: 14.75,31.3 17,31.3 17,30.8 18.47,30.8 18.47,26.02 16.94,26.02 16.94,26.77 14.78,26.77 14.78,31.27
+12V on Top Layer: 17.7,25.07 17.7,23.93 19.58,23.93 19.58,25.07
+12V on Bottom Layer: 19.08,9.64 21.13,9.64 21.13,9.3 22.93,9.3 22.93,4.75 21,4.75 21,5.48 19.09,5.48 19.08,5.49
+12V on Inner1: 20.17,8.43 20.17,6.73 22.4,6.73 22.4,8.31 21,9.7 21.55,17.31 20.65,16.4 20.65,17.11 20.37,17.11 20.37,16.17 20.23,16.17 19.99,15.93 19.99,14.84 20.24,14.59
+12V on Inner1: 19.54,24.05 20.76,22.77 20.75,22.78 20.75,17.33 20.26,16.84 20.26,16.09 20.03,15.86 20.03,14.86 20.24,14.66 21.51,14.66 21.54,14.61 21.64,22.25 21.61,22.28 21.61,24.24 20.64,25.21 20.47,25.04 18.09,25.04 18.05,25.01 18.05,24.05
AGND on Inner2: 25.32,12.68 26.51,13.87 26.68,13.87 26.68,31.13 26.72,31.17 26.46,31.42 24.56,31.42 24.56,28.5 25.45,27.61 25.32,27.48
GND on Top Layer: -1.35,40.56 39.29,40.56 39.29,-1.22 -1.35,-1.22
GND on Bottom Layer: -0.84,42.85 42.59,42.85 42.59,-1.73 -0.84,-1.73
GND on Inner1: -1.1,42.34 40.94,42.34 40.94,-2.74 -1.1,-2.74
PGND on Top Layer: 25.21,0.91 25.2,0.83 25.16,0.77 25.09,0.72 25.01,0.71 23,0.71 22.93,0.72 22.86,0.77 22.82,0.83 22.8,0.91 22.8,3.17 22.82,3.25 22.86,3.31 22.93,3.36 23,3.37 25.01,3.37 25.09,3.36 25.16,3.31 25.2,3.25 25.21,3.17
PGND on Top Layer: 17.45,39.73 17.46,39.8 17.51,39.87 17.57,39.91 17.65,39.93 19.66,39.93 19.73,39.91 19.8,39.87 19.84,39.8 19.86,39.73 19.86,37.46 19.84,37.39 19.8,37.32 19.73,37.28 19.66,37.26 17.65,37.26 17.57,37.28 17.51,37.32 17.46,37.39 17.45,37.46
PGND on Top Layer: 17.32,41.2 17.32,37.35 17.47,37.2 18.8,37.2 21.26,34.74 21.26,32.71 19.8,31.26 18.41,31.26 18.41,30.72 18.98,30.15 19.86,30.15 21.26,31.55 21.38,31.55 22.15,30.78 22.15,29.08 27.32,29.08 27.32,9.07 24.69,9.07 24.69,7.42 22.78,5.51 22.78,-0.33 44.12,-0.33 44.12,41.83 17.95,41.83
PGND on Bottom Layer: 17.19,40.44 17.19,37.01 18.16,37.01 21.26,33.91 21.26,33.32 22.02,32.56 22.02,29.22 22.64,28.6 22.64,27.27 25.6,24.31 25.83,24.31 25.83,9.7 25.65,9.53 25.65,6.35 22.78,3.48 22.78,-0.33 22.91,-0.46 38.91,-0.46 39.29,-0.08 39.29,40.31 39.16,40.44
PGND on Inner1: 17.25,25.03 20.63,28.41 20.63,28.6 27.12,28.6 27.48,28.24 27.48,24.43 27.86,24.05 30.45,24.05 30.27,23.87 30.27,21.26 24.75,21.26 24.6,21.11 24.6,22.12 21.6,25.12 21.51,25.03
PGND on Inner2: -1.22,41.96 39.93,41.96 39.93,-0.58 -0.71,-0.58 -0.71,41.45
VCC on Top Layer: 20.62,39.73 20.64,39.8 20.68,39.87 20.75,39.91 20.82,39.93 22.83,39.93 22.91,39.91 22.97,39.87 23.02,39.8 23.03,39.73 23.03,37.46 23.02,37.39 22.97,37.32 22.91,37.28 22.83,37.26 20.82,37.26 20.75,37.28 20.68,37.32 20.64,37.39 20.62,37.46
VCC on Top Layer: 26.84,7.8 26.84,6.02 25.96,6.02 25.96,0.92 28.37,0.92 28.37,4.11 29.38,4.11 29.38,6 28.35,6 28.35,7.79 28.34,7.8
VCC on Top Layer: 28.39,1.5 28.37,1.42 28.33,1.35 28.26,1.31 28.19,1.29 26.18,1.29 26.1,1.31 26.04,1.35 25.99,1.42 25.98,1.5 25.98,3.76 25.99,3.84 26.04,3.9 26.1,3.95 26.18,3.96 28.19,3.96 28.26,3.95 28.33,3.9 28.37,3.84 28.39,3.76
VCC on Top Layer: 20.62,39.87 20.62,37.34 23.41,37.34 24.3,36.3 25.45,35.23 26.38,33.47 27.28,33.85 30.53,35.36 30.49,35.39 29.77,36.91 29.77,37.9 30.02,38.15 28.21,39.96 24.3,39.96 24.22,39.87
VCC on Bottom Layer: 15.33,33.58 15.33,31.42 19.35,31.42 19.35,33.6 15.35,33.6
VCC on Bottom Layer: 20.62,40.14 20.62,37.31 22.83,37.31 26.65,33.5 27.28,33.5 27.28,28.93 27.39,28.82 29.83,28.82 29.83,11.01 29.51,10.7 29.51,10.59 28.22,10.59 28.22,9.5 27.7,8.98 27.7,8.53 26.84,7.67 26.84,6.03 26.02,6.03 26.02,0.78 28.37,0.78 28.37,4.19 29.51,4.19 29.51,6.02 28.5,6.02 28.5,7.92 30.53,9.96 30.55,9.96 31.43,10.84 31.43,12.83 32.18,12.83 32.18,14.36 32.4,14.58 32.85,14.58 32.85,17.32 32.21,17.32 32.21,21.05 32.75,21.05 32.75,23.93 32.21,23.93 32.21,27.61 32.68,27.61 32.68,35.61 28.11,40.18 28.11,40.56 27.69,40.14
VCC on Bottom Layer: 19.42,11.91 23.42,11.91 23.42,9.64 21.38,9.64 21.38,9.97 19.48,9.97 19.42,10.02
VCC on Inner1: 20.68,40.49 20.68,35.76 18.41,33.49 15.29,33.49 15.29,32.31 19.5,32.31 23.03,35.84 23.03,40.37 20.8,40.37
VCC on Inner1: 21.09,11.91 21.09,9.62 22.76,7.95 26.25,7.95 26.65,7.55 26.65,6.6 25.82,5.77 25.83,5.77 25.96,5.89 25.96,0.81 28.37,0.81 28.37,4.4 29.51,4.4 29.51,5.89 28.6,5.89 28.6,7.28 26.81,9.07 24.56,9.07 22.88,10.74 22.72,10.74 22.72,11.95 21.12,11.95
VCC on Inner2: 20.49,40.31 20.49,37.23 21.16,37.23 23.8,34.59 25.31,34.59 29.81,30.1 29.81,14.36 30.37,13.8 29.81,13.8 29.81,11.4 26.46,8.05 26.46,6.15 25.81,5.49 25.81,0.71 25.96,0.56 28.5,0.56 28.62,0.69 28.62,3.62 29.47,4.47 29.47,8.72 31.14,10.39 33.19,10.39 33.19,40.69 20.88,40.69
SH_A on Top Layer: 32.81,29.64 34.21,29.64 34.21,27.29 35.99,25.52 35.99,22.31 34.21,22.31 34.21,24.05 31.29,24.05 31.29,27.23 32.82,27.23 32.81,27.23
SH_B on Top Layer: 34.08,22.78 32.94,22.78 32.94,20.24 31.46,20.24 31.46,17.45 34.08,17.45 34.08,18.53 35.99,18.53 35.99,22.08 34.08,22.08
SH_C on Top Layer: 34.34,10.58 31.54,10.58 31.54,13.64 33.18,13.64 33.18,15.9 34.34,15.9 34.34,18.23 35.99,18.23 35.99,14.46 34.34,12.81 34.34,10.59
SL_A on Top Layer: 27.9,24.93 30.91,24.93 30.91,26.77 27.91,26.77 27.91,24.94
SL_B on Top Layer: 27.86,19.99 30.99,19.99 30.99,18.15 27.86,18.15
SL_C on Top Layer: 27.86,13.26 30.95,13.26 30.95,11.48 27.86,11.48
$1N8721 on Bottom Layer: 16.7,11.56 19.17,11.56 19.22,11.61 19.22,9.96 18.76,9.96 18.76,5.26 16.68,5.26 16.68,11.54
$1N8733 on Bottom Layer: 12.31,33.15 14.86,33.15 14.91,33.2 14.91,31.51 14.08,31.51 14.08,26.97 12.4,26.97 12.31,27.07

Small or netless copper shapes (teardrops, artwork), in the pictures only: 1 on Inner1

## Text on the board
Bottom Silkscreen Layer: ▲ | MT6701 | PGND | VCC | SCK | SWD | RX | TX | GND | 3.3V | |+A3.3V| | |+5V| | |+12V|
Top Silkscreen Layer: ▲ | PGND | CANH | |+3.3V| | VCC | CANL | 33.45mm | 2.5mm | MISO | SCK | CS | +3V3 | GND | MCU> | Motor GIM-V1.1 | Driver> | STM32G431CBU6 | FOC_FD6288Q / Version->V3.0 | FD6288Q | |RST| | KEY1 | A | B | C
